# Altium schematic sheet spartan6-0.SchDoc
size 389 x 250 mm; SheetNumber: 1; SheetTotal: 8
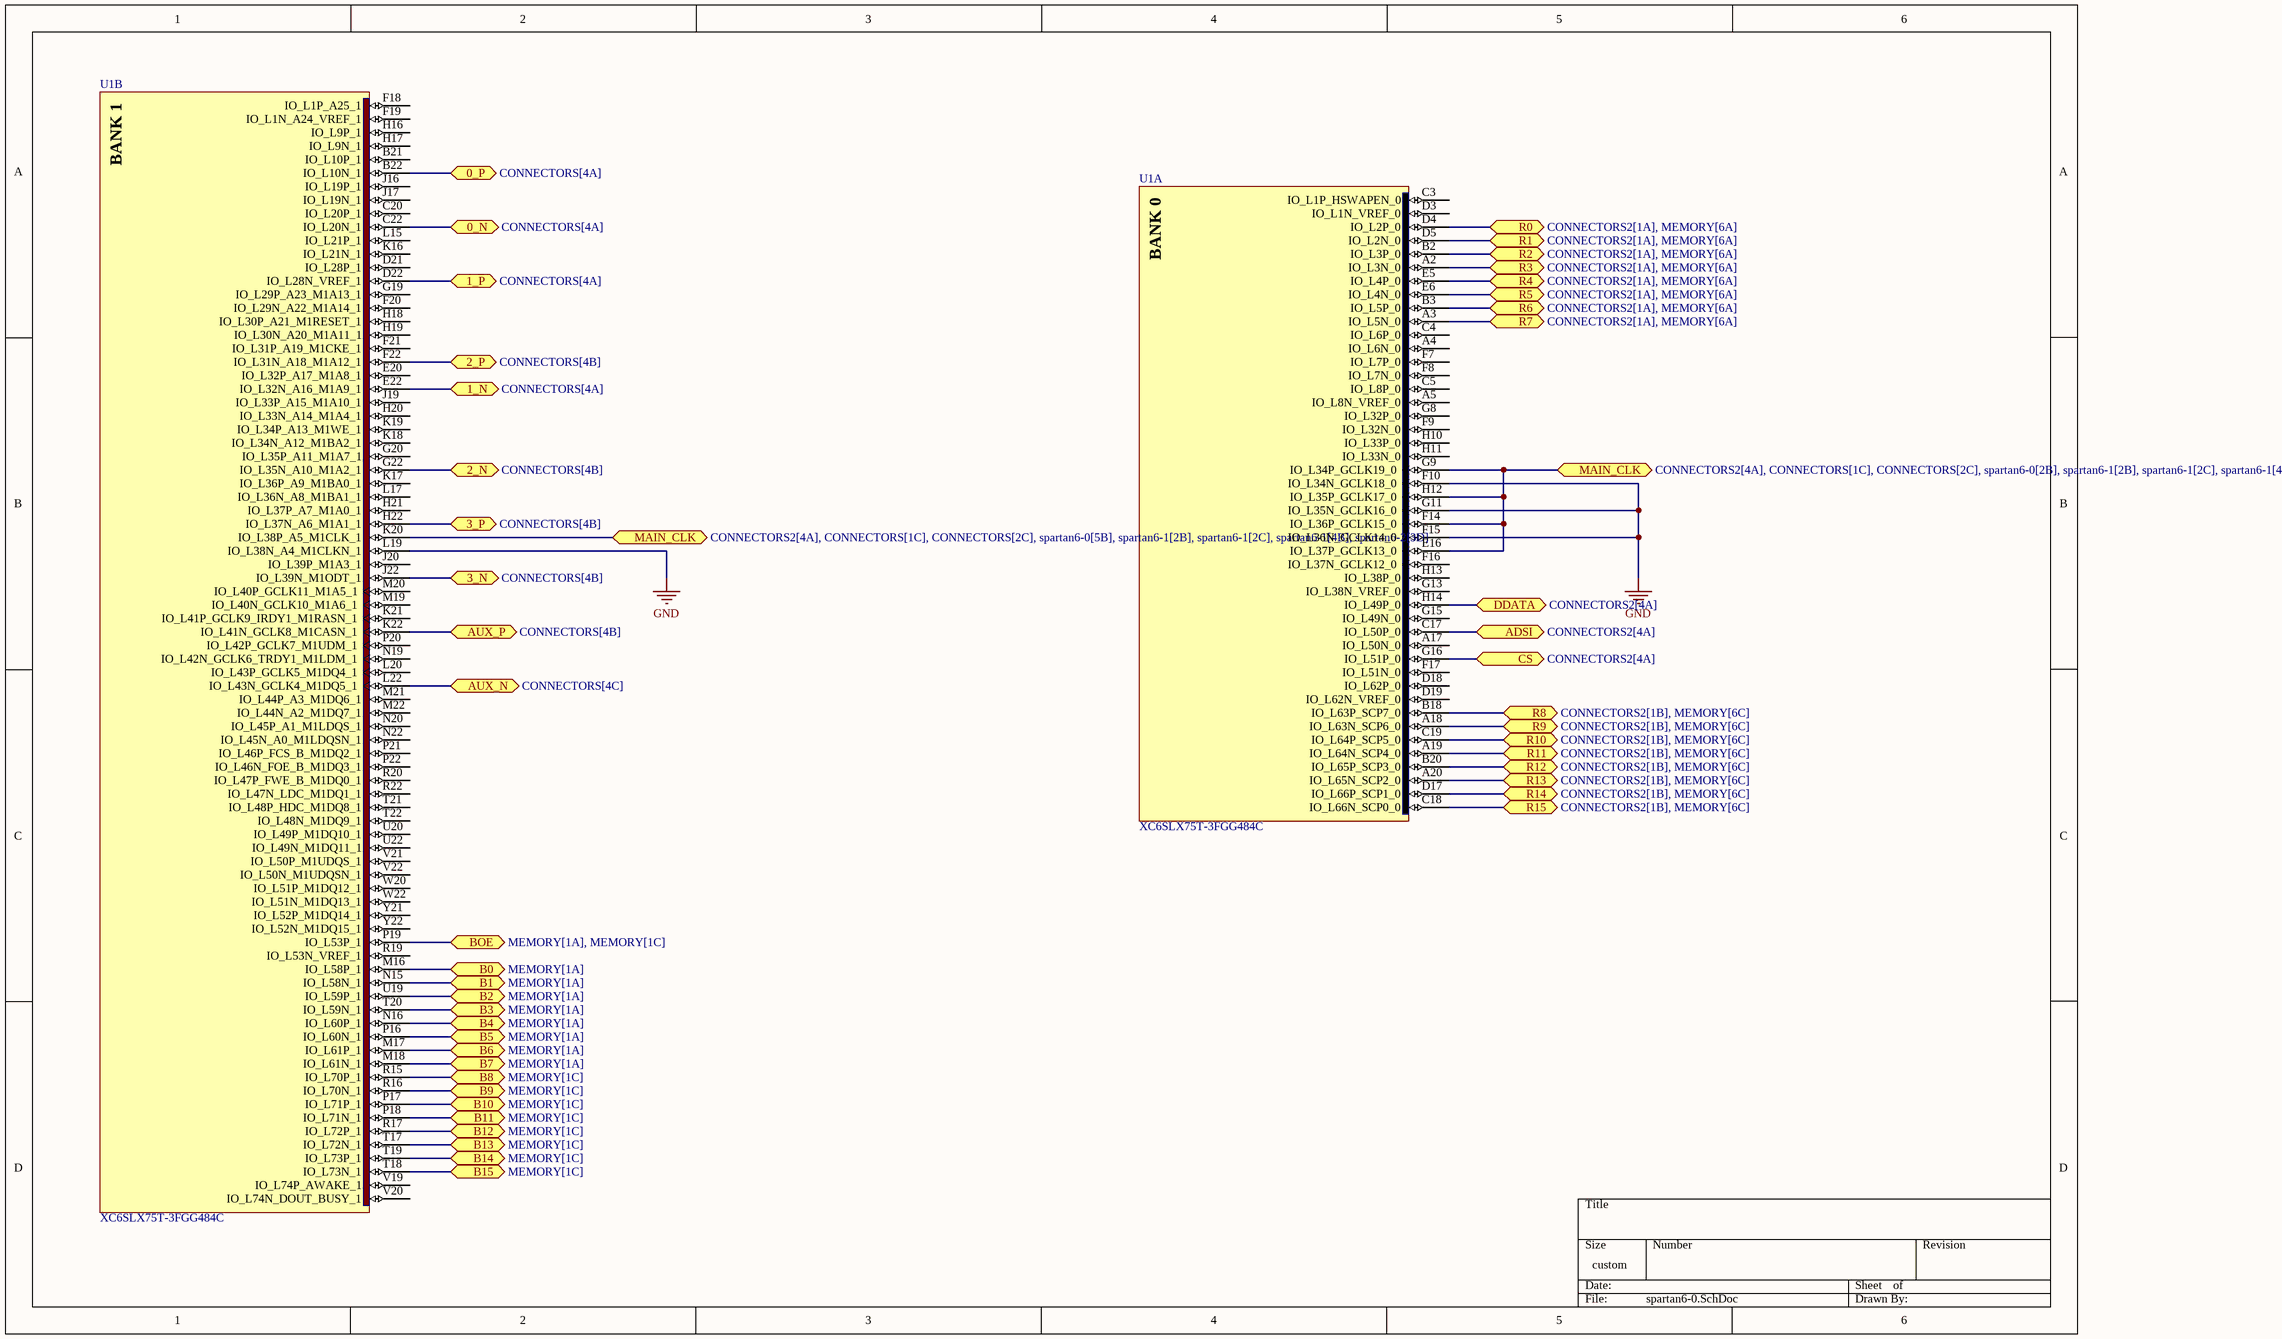
[diagram p0: spartan6-0.SchDoc]

## Parts
U1  XC6SLX75T-3FGG484C  [FGG484]  (parts A,B of 9)

## Ports
0_N (bidir, see CONNECTORS[4A]), 0_P (bidir, see CONNECTORS[4A]), 1_N (bidir, see CONNECTORS[4A]), 1_P (bidir, see CONNECTORS[4A]), 2_N (bidir, see CONNECTORS[4B]), 2_P (bidir, see CONNECTORS[4B]), 3_N (bidir, see CONNECTORS[4B]), 3_P (bidir, see CONNECTORS[4B]), ADSI (bidir, see CONNECTORS2[4A]), AUX_N (bidir, see CONNECTORS[4C]), AUX_P (bidir, see CONNECTORS[4B]), B0 (bidir, see MEMORY[1A]), B1 (bidir, see MEMORY[1A]), B2 (bidir, see MEMORY[1A]), B3 (bidir, see MEMORY[1A]), B4 (bidir, see MEMORY[1A]), B5 (bidir, see MEMORY[1A]), B6 (bidir, see MEMORY[1A]), B7 (bidir, see MEMORY[1A]), B8 (bidir, see MEMORY[1C]), B9 (bidir, see MEMORY[1C]), B10 (bidir, see MEMORY[1C]), B11 (bidir, see MEMORY[1C]), B12 (bidir, see MEMORY[1C]), B13 (bidir, see MEMORY[1C]), B14 (bidir, see MEMORY[1C]), B15 (bidir, see MEMORY[1C]), BOE (bidir, see MEMORY[1A], MEMORY[1C]), CS (bidir, see CONNECTORS2[4A]), DDATA (bidir, see CONNECTORS2[4A]), MAIN_CLK (bidir, see CONNECTORS2[4A], CONNECTORS[1C], CONNECTORS[2C], spartan6-0[2B], spartan6-1[2B], spartan6-1[2C], spartan6-1[4B], spartan6-2[3D]), MAIN_CLK (bidir, see CONNECTORS2[4A], CONNECTORS[1C], CONNECTORS[2C], spartan6-0[5B], spartan6-1[2B], spartan6-1[2C], spartan6-1[4B], spartan6-2[3D]), R0 (bidir, see CONNECTORS2[1A], MEMORY[6A]), R1 (bidir, see CONNECTORS2[1A], MEMORY[6A]), R2 (bidir, see CONNECTORS2[1A], MEMORY[6A]), R3 (bidir, see CONNECTORS2[1A], MEMORY[6A]), R4 (bidir, see CONNECTORS2[1A], MEMORY[6A]), R5 (bidir, see CONNECTORS2[1A], MEMORY[6A]), R6 (bidir, see CONNECTORS2[1A], MEMORY[6A]), R7 (bidir, see CONNECTORS2[1A], MEMORY[6A]), R8 (bidir, see CONNECTORS2[1B], MEMORY[6C]), R9 (bidir, see CONNECTORS2[1B], MEMORY[6C]), R10 (bidir, see CONNECTORS2[1B], MEMORY[6C]), R11 (bidir, see CONNECTORS2[1B], MEMORY[6C]), R12 (bidir, see CONNECTORS2[1B], MEMORY[6C]), R13 (bidir, see CONNECTORS2[1B], MEMORY[6C]), R14 (bidir, see CONNECTORS2[1B], MEMORY[6C]), R15 (bidir, see CONNECTORS2[1B], MEMORY[6C])

## Nets
GND: U1.F10(IO_L34N_GCLK18_0) U1.F15(IO_L36N_GCLK14_0) U1.G11(IO_L35N_GCLK16_0) U1.L19(IO_L38N_A4_M1CLKN_1)
0_N: U1.C22(IO_L20N_1) ; port 0_N
0_P: U1.B22(IO_L10N_1) ; port 0_P
1_N: U1.E22(IO_L32N_A16_M1A9_1) ; port 1_N
1_P: U1.D22(IO_L28N_VREF_1) ; port 1_P
2_N: U1.G22(IO_L35N_A10_M1A2_1) ; port 2_N
2_P: U1.F22(IO_L31N_A18_M1A12_1) ; port 2_P
3_N: U1.J22(IO_L39N_M1ODT_1) ; port 3_N
3_P: U1.H22(IO_L37N_A6_M1A1_1) ; port 3_P
ADSI: U1.C17(IO_L50P_0) ; port ADSI
AUX_N: U1.L22(IO_L43N_GCLK4_M1DQ5_1) ; port AUX_N
AUX_P: U1.K22(IO_L41N_GCLK8_M1CASN_1) ; port AUX_P
B0: U1.M16(IO_L58P_1) ; port B0
B1: U1.N15(IO_L58N_1) ; port B1
B2: U1.U19(IO_L59P_1) ; port B2
B3: U1.T20(IO_L59N_1) ; port B3
B4: U1.N16(IO_L60P_1) ; port B4
B5: U1.P16(IO_L60N_1) ; port B5
B6: U1.M17(IO_L61P_1) ; port B6
B7: U1.M18(IO_L61N_1) ; port B7
B8: U1.R15(IO_L70P_1) ; port B8
B9: U1.R16(IO_L70N_1) ; port B9
B10: U1.P17(IO_L71P_1) ; port B10
B11: U1.P18(IO_L71N_1) ; port B11
B12: U1.R17(IO_L72P_1) ; port B12
B13: U1.T17(IO_L72N_1) ; port B13
B14: U1.T19(IO_L73P_1) ; port B14
B15: U1.T18(IO_L73N_1) ; port B15
BOE: U1.P19(IO_L53P_1) ; port BOE
CS: U1.G16(IO_L51P_0) ; port CS
DDATA: U1.H14(IO_L49P_0) ; port DDATA
MAIN_CLK: U1.E16(IO_L37P_GCLK13_0) U1.F14(IO_L36P_GCLK15_0) U1.G9(IO_L34P_GCLK19_0) U1.H12(IO_L35P_GCLK17_0) U1.K20(IO_L38P_A5_M1CLK_1) ; port MAIN_CLK
R0: U1.D4(IO_L2P_0) ; port R0
R1: U1.D5(IO_L2N_0) ; port R1
R2: U1.B2(IO_L3P_0) ; port R2
R3: U1.A2(IO_L3N_0) ; port R3
R4: U1.E5(IO_L4P_0) ; port R4
R5: U1.E6(IO_L4N_0) ; port R5
R6: U1.B3(IO_L5P_0) ; port R6
R7: U1.A3(IO_L5N_0) ; port R7
R8: U1.B18(IO_L63P_SCP7_0) ; port R8
R9: U1.A18(IO_L63N_SCP6_0) ; port R9
R10: U1.C19(IO_L64P_SCP5_0) ; port R10
R11: U1.A19(IO_L64N_SCP4_0) ; port R11
R12: U1.B20(IO_L65P_SCP3_0) ; port R12
R13: U1.A20(IO_L65N_SCP2_0) ; port R13
R14: U1.D17(IO_L66P_SCP1_0) ; port R14
R15: U1.C18(IO_L66N_SCP0_0) ; port R15

Not connected (* = marked no-connect by the designer): U1 A4(IO_L6N_0) A5(IO_L8N_VREF_0) A17(IO_L50N_0) B21(IO_L10P_1) C3(IO_L1P_HSWAPEN_0) C4(IO_L6P_0) C5(IO_L8P_0) C20(IO_L20P_1) D3(IO_L1N_VREF_0) D18(IO_L62P_0) D19(IO_L62N_VREF_0) D21(IO_L28P_1) E20(IO_L32P_A17_M1A8_1) F7(IO_L7P_0) F8(IO_L7N_0) F9(IO_L32N_0) F16(IO_L37N_GCLK12_0) F17(IO_L51N_0) F18(IO_L1P_A25_1) F19(IO_L1N_A24_VREF_1) F20(IO_L29N_A22_M1A14_1) F21(IO_L31P_A19_M1CKE_1) G8(IO_L32P_0) G13(IO_L38N_VREF_0) G15(IO_L49N_0) G19(IO_L29P_A23_M1A13_1) G20(IO_L35P_A11_M1A7_1) H10(IO_L33P_0) H11(IO_L33N_0) H13(IO_L38P_0) H16(IO_L9P_1) H17(IO_L9N_1) H18(IO_L30P_A21_M1RESET_1) H19(IO_L30N_A20_M1A11_1) H20(IO_L33N_A14_M1A4_1) H21(IO_L37P_A7_M1A0_1) J16(IO_L19P_1) J17(IO_L19N_1) J19(IO_L33P_A15_M1A10_1) J20(IO_L39P_M1A3_1) K16(IO_L21N_1) K17(IO_L36P_A9_M1BA0_1) K18(IO_L34N_A12_M1BA2_1) K19(IO_L34P_A13_M1WE_1) K21(IO_L41P_GCLK9_IRDY1_M1RASN_1) L15(IO_L21P_1) L17(IO_L36N_A8_M1BA1_1) L20(IO_L43P_GCLK5_M1DQ4_1) M19(IO_L40N_GCLK10_M1A6_1) M20(IO_L40P_GCLK11_M1A5_1) M21(IO_L44P_A3_M1DQ6_1) M22(IO_L44N_A2_M1DQ7_1) N19(IO_L42N_GCLK6_TRDY1_M1LDM_1) N20(IO_L45P_A1_M1LDQS_1) N22(IO_L45N_A0_M1LDQSN_1) P20(IO_L42P_GCLK7_M1UDM_1) P21(IO_L46P_FCS_B_M1DQ2_1) P22(IO_L46N_FOE_B_M1DQ3_1) R19(IO_L53N_VREF_1) R20(IO_L47P_FWE_B_M1DQ0_1) R22(IO_L47N_LDC_M1DQ1_1) T21(IO_L48P_HDC_M1DQ8_1) T22(IO_L48N_M1DQ9_1) U20(IO_L49P_M1DQ10_1) U22(IO_L49N_M1DQ11_1) V19(IO_L74P_AWAKE_1) V20(IO_L74N_DOUT_BUSY_1) V21(IO_L50P_M1UDQS_1) V22(IO_L50N_M1UDQSN_1) W20(IO_L51P_M1DQ12_1) W22(IO_L51N_M1DQ13_1) Y21(IO_L52P_M1DQ14_1) Y22(IO_L52N_M1DQ15_1)

## Notes on the sheet
- (in symbol CMP-0067-00082-1, part A) BANK 0
- (in symbol CMP-0067-00082-1, part B) BANK 1

## Library data of the parts
U1 = CMP-0067-00082-1: Spartan-6 LXT 1.2V FPGA, 268 User I/Os, 484-Ball Fine-Pitch BGA (1.0mm Pitch), Speed Grade 3, Commercial Grade, Pb-Free; PackageDescription: 484-Ball Fine Pitch Ball Grid Array 1.00 mm Pitch (FGG484) - Pb-Free; PackageVersion: ver1.1, Dec-2008; DatasheetVersion: ver1.6, Nov-2010; Code_JEDEC: MS-034-AAJ-1; Code_IPC: BGA100P22X22-484; PackageReference: FGG484